# Altium schematic sheet Power.SchDoc
size A; SheetNumber: 4; SheetTotal: 5
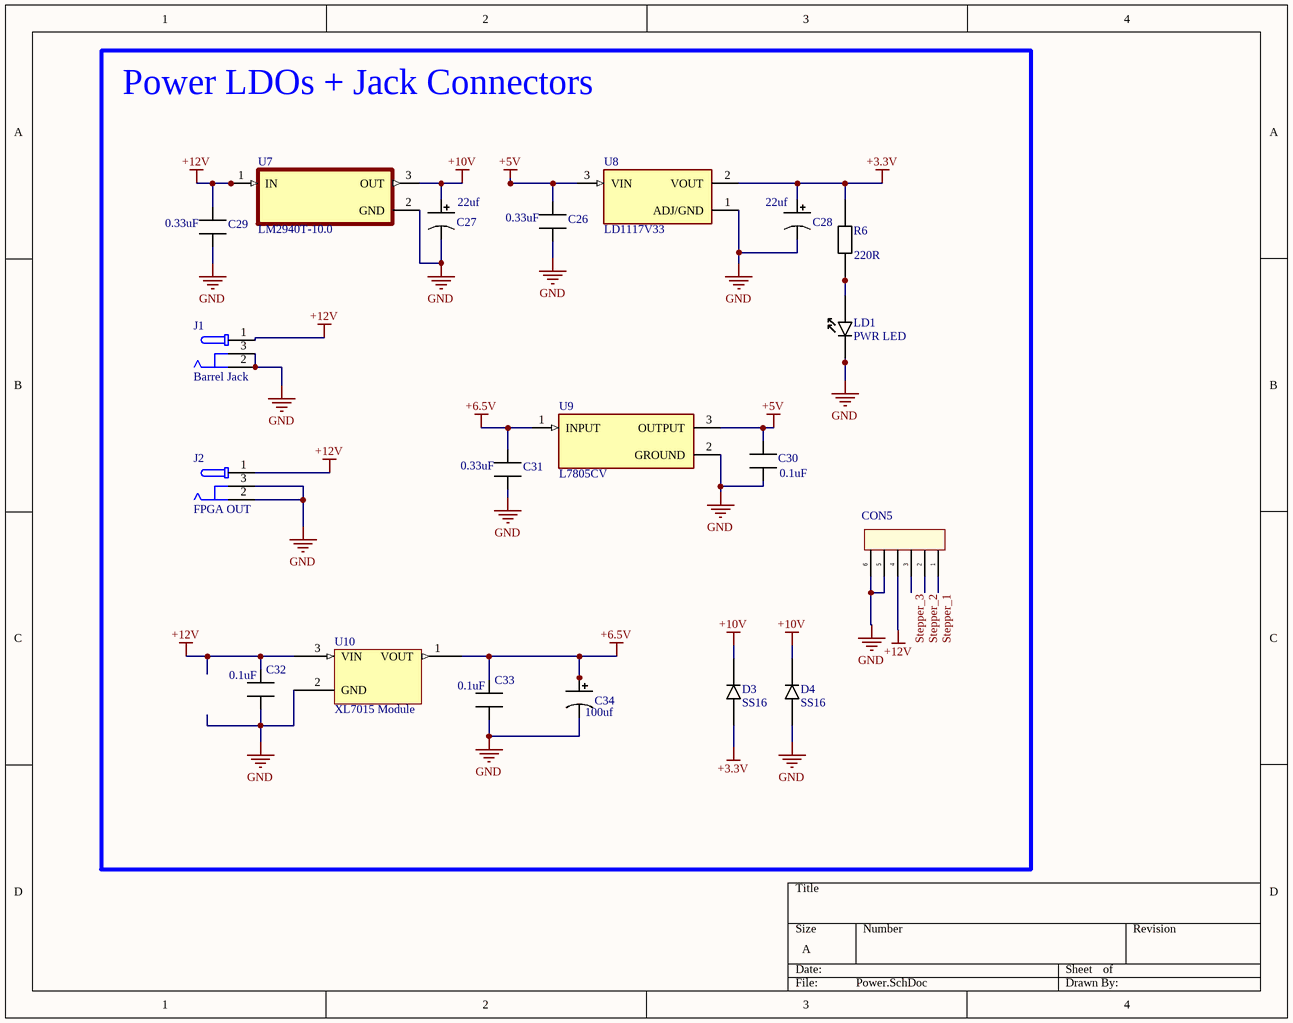
[diagram p0: Power.SchDoc]

## Parts
C26  0.33uF  [CAP_0805]
C27  22uf  [CAP_CAN_D5MM]
C28  22uf  [CAP_CAN_D5MM]
C29  0.33uF  [CAP_0805]
C30  0.1uF  [CAP_0805]
C31  0.33uF  [CAP_0805]
C32  0.1uF  [CAP_0805]
C33  0.1uF  [CAP_0805]
C34  100uf  [CAP_CAN_D5MM]
CON5  KF2EDGV-bend-3.81-6p  [CONGREEN_1x6_3.81]  (value not drawn)
D3  SS16  [DO-214AC]
D4  SS16  [DO-214AC]
J1  Barrel Jack  [MPD_EJ503A]
J2  FPGA OUT  [MPD_EJ503A]
LD1  PWR LED  [LED_0805]
R6  220R  [RES_0805]
U7  LM2940T-10.0  [TO254P1054X470X1955-3]
U8  LD1117V33  [TO255P1020X450X1968-3]
U9  L7805CV  [TO255P1040X460X1968-3]
U10  XL7015 Module  [XL7015]

## Blocks framed on the sheet
Power LDOs + Jack Connectors: C26-C34 CON5 D3 D4 J1 J2 LD1 R6 U7-U10

## Nets
+3.3V: C28.1 D3.2 R6.2 U8.2(VOUT)
+5V: C26.2 C30.2 U8.3(VIN) U9.3(OUTPUT)
+6.5V: C31.2 C33.2 C34.1 U9.1(INPUT) U10.1(VOUT)
+10V: C27.1 D3.1 D4.1 U7.3(OUT)
+12V: C29.2 C32.2 CON5.4 J1.1 J2.1 U7.1(IN) U10.3(VIN)
GND: C26.1 C27.2 C28.2 C29.1 C30.1 C31.1 C32.1 C33.1 C34.2 CON5.5 CON5.6 D4.2 J1.2 J1.3 J2.2 J2.3 LD1.1 U7.2(GND) U8.1(ADJ/GND) U9.2(GROUND) U10.2(GND)
Stepper_1: CON5.1
Stepper_2: CON5.2
Stepper_3: CON5.3
NetLD1_2: LD1.2 R6.1

## Library data of the parts
C26 C29-C33 = CAP_0805: note: any manufacturer
  C26 C29 C31: val: 0.33uF
  C30 C32 C33: val: 0.1uF
C27 C28 C34 = CAP_CAN_D5mm: SMD Can Capacitor; 5mm Diameter; note: any manufacturer; sample link: https://www.lcsc.com/product-detail/C3357.html?s_z=n_10uF%2520SMD%2520Can%2520Capacitor%2520D5%2520RVT
  C27 C28: val: 22uf
  C34: val: 100uf
CON5 = CONGREEN_1x6_3.81: note: any manufacturer; val: KF2EDGV-bend-3.81-6p; sample link: https://detail.tmall.com/item.htm?abbucket=7&id=563239224672&mi_id=0000eNg2RX4a54sA2dO6nQBcXewI5pOIaHq0cbOnq7H1ZG4&ns=1&priceTId=2100c82417719338414588309e0c91&skuId=3549204641034&spm=a21n57.1.hoverItem.2&utparam=%7B%22aplus_abtest%22%3A%22cd8050d06d499e492f7c0b37ee11abfb%22%7D&xxc=taobaoSearch
D3 D4 = SS16: Independent 60V 700mV@1A 1A SMA(DO-214AC) Single Diodes RoHS; note: any manufacturer; val: SS16; sample link: https://www.lcsc.com/product-detail/Schottky-Barrier-Diodes-SBD_GOODWORK-SS16_C2943739.html; unit price: $ 0.0122
J1 J2 = EJ503A: Power Barrel Connector Jack 2.10mm ID (0.083), 5.50mm OD (0.217) Through Hole, Right Angle; MF: MPD; Package: None; Price: None; Check_prices: https://www.snapeda.com/parts/EJ503A/MPD+%2528Memory+Protection+Devices%2529/view-part/?ref=eda; Value: *; SnapEDA_Link: https://www.snapeda.com/parts/EJ503A/MPD+%2528Memory+Protection+Devices%2529/view-part/?ref=snap; MP: EJ503A; Availability: In Stock; Purchase-URL: https://pricing.snapeda.com/search?q=EJ503A&ref=eda
LD1 = LED_0805
R6 = RES_0805: note: any manufacturer; val: 220R
U7 = LM2940T-10.0: 1-A, 26-V, high-PSRR, low-dropout voltage regulator 3-TO-220 -40 to 125; MF: Texas Instruments; MP: LM2940T-5.0; SnapEDA_Link: https://www.snapeda.com/parts/LM2940T-5.0/Texas+Instruments/view-part/?ref=snap; Package: TO-220-3 Texas Instruments; Value: *; Check_prices: https://www.snapeda.com/parts/LM2940T-5.0/Texas+Instruments/view-part/?ref=eda
U8 = LD1117V33: Linear Voltage Regulator IC Positive Fixed 1 Output 800mA TO-220AB; MF: STMicroelectronics; SnapEDA_Link: https://www.snapeda.com/parts/LD1117V33/STMicroelectronics/view-part/?ref=snap; Package: TO-220-3 STMicroelectronics; Value: *; MP: LD1117V33; Check_prices: https://www.snapeda.com/parts/LD1117V33/STMicroelectronics/view-part/?ref=eda
U9 = L7805CV: Linear Voltage Regulator IC Positive Fixed 1 Output 1.5A TO-220; MF: STMicroelectronics; SnapEDA_Link: https://www.snapeda.com/parts/L7805CV/STMicroelectronics/view-part/?ref=snap; Package: TO-220-3 STMicroelectronics; Value: *; MP: L7805CV; Check_prices: https://www.snapeda.com/parts/L7805CV/STMicroelectronics/view-part/?ref=eda
U10 = XL7015: Buck Converter